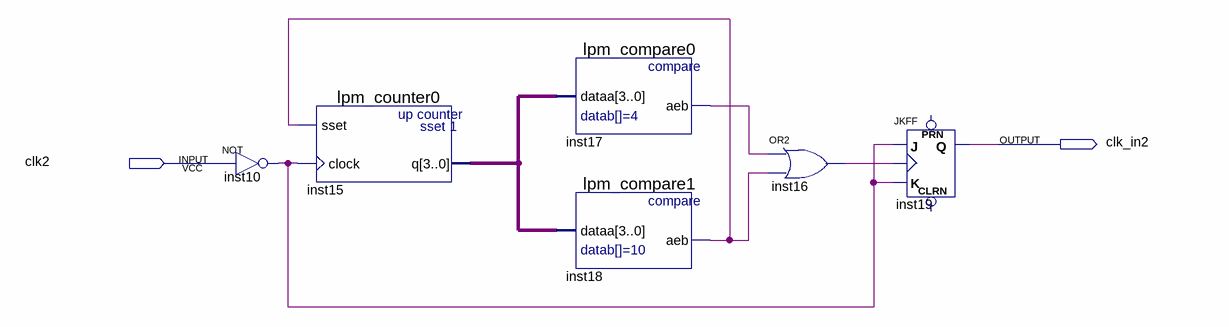
[diagram p0: schematic sheet]
// Quartus schematic Block1_functional.bdf as structural Verilog: 6 symbols, 2 pins
module Block1_functional (
  input  clk2,
  output clk_in2
);

  wire inst10_out, inst16_out, inst17_aeb, inst18_aeb;
  wire [3:0] inst15_q;

  not inst10 (inst10_out, clk2);
  lpm_counter0 inst15 (.sset(inst18_aeb), .clock(inst10_out), .q(inst15_q));
  lpm_compare0 inst17 (.dataa(inst15_q), .aeb(inst17_aeb));
  lpm_compare1 inst18 (.dataa(inst15_q), .aeb(inst18_aeb));
  or inst16 (inst16_out, inst17_aeb, inst18_aeb);
  JKFF inst19 (.K(inst10_out), .J(inst10_out), .CLK(inst16_out), .Q(clk_in2));  // open: PRN, CLRN
endmodule
